# EAGLE design shield_layer2 (EAGLE 7.3.0)
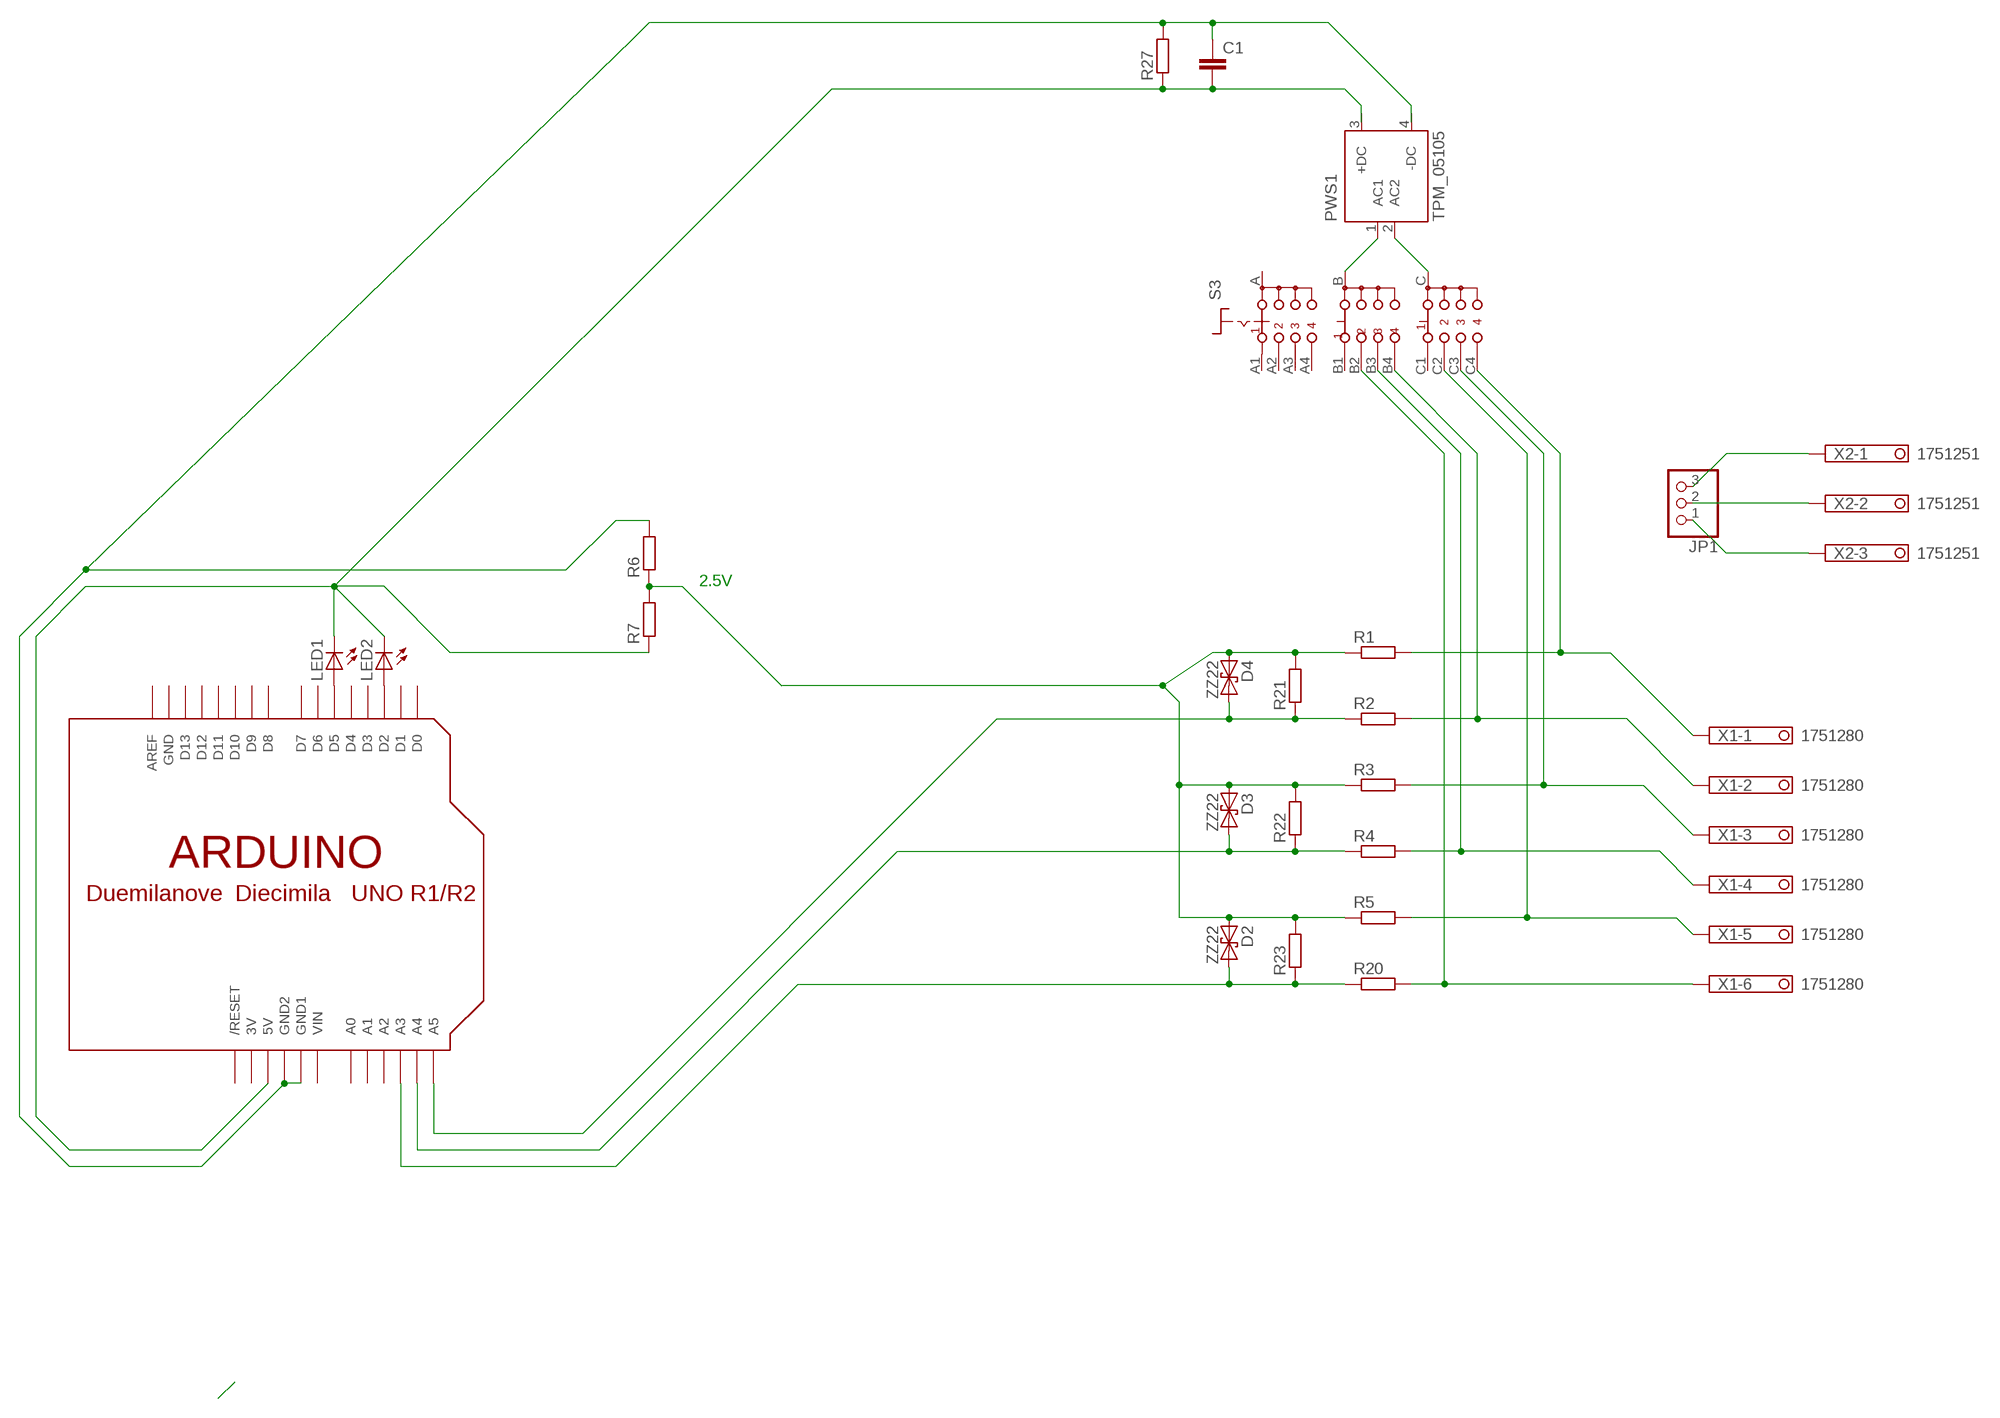
[diagram p0: schematic, sheet 1]

## Parts
C1  C-EU050-045X075  [C050-045X075]
D2  ZZ22  [P2-15]
D3  ZZ22  [P2-15]
D4  ZZ22  [P2-15]
JP1  PINHD-1X3CB  [1X03-CLEANBIG]
LED1  LED5MM  [LED5MM]
LED2  LED5MM  [LED5MM]
PWS1  TPM_05105  [05105]
R1  R-EU_0617/22  [0617/22]
R2  R-EU_0617/22  [0617/22]
R3  R-EU_0617/22  [0617/22]
R4  R-EU_0617/22  [0617/22]
R5  R-EU_0617/22  [0617/22]
R6  R-EU_0207/10  [0207/10]
R7  R-EU_0207/10  [0207/10]
R20  R-EU_0617/22  [0617/22]
R21  R-EU_0207/10  [0207/10]
R22  R-EU_0207/10  [0207/10]
R23  R-EU_0207/10  [0207/10]
R27  R-EU_0207/10  [0207/10]
S3  CK103X04  [CK103X04]
U$1  ARDUINOUNO  [ARDUINO]
X1  1751280  [1751280]
X2  1751251  [1751251]

## Nets
N$1: C1.2 LED1.K(C) LED2.K(C) R7.1 R27.1 U$1.5V
N$2: PWS1.1(AC1) S3.B
N$3: JP1.3 X2.1
N$4: JP1.2 X2.2
N$5: JP1.1 X2.3
N$6: PWS1.2(AC2) S3.C
N$13: D2.C R20.1 R23.1 U$1.A3
N$14: D3.C R4.1 R22.1 U$1.A4
N$18: D4.C R2.1 R21.1 U$1.A5
N$22: C1.1 R6.2 R27.2 U$1.GND1 U$1.GND2
N$35: LED2.A U$1.D2
N$36: LED1.A U$1.D5
N$41: R1.2 S3.C4 X1.1
N$43: R3.2 S3.C3 X1.3
N$44: D2.A D3.A D4.A R1.1 R3.1 R5.1 R6.1 R7.2 R21.2 R22.2 R23.2
N$45: R5.2 S3.C2 X1.5
N$46: R20.2 S3.B2 X1.6
N$47: R2.2 S3.B4 X1.2
N$48: R4.2 S3.B3 X1.4
Unconnected: PWS1.3(+DC) PWS1.4(-DC) S3.A S3.A1 S3.A2 S3.A3 S3.A4 S3.B1 S3.C1 U$1.A0 U$1.A1 U$1.A2 U$1.AREF U$1.D0 U$1.D1 U$1.D3 U$1.D4 U$1.D6 U$1.D7 U$1.D8 U$1.D9 U$1.D10 U$1.D11 U$1.D12 U$1.D13 U$1.RESET(/RESET)

## Notes on the sheet
- 2.5V

## Power pins joined to a net without a drawn wire
3V: U$1.3V
GND: U$1.GND
VIN: U$1.VIN

## Library data of the parts
C1 = resistor:C-EU: CAPACITOR, European symbol
D2-D4 = diode:ZZ22: DIODE
JP1 = adafruit:PINHD-1X3: PIN HEADER
LED1 LED2 = led:LED: LED OSRAM: - CHIPLED LG R971, LG N971, LY N971, LG Q971, LY Q971, LO R971, LY R971 LH N974, LH R974 LS Q976, LO Q976, LY Q976 LO Q996 - Hyper CHIPLED LW Q18S LB Q993, LB Q99A, LB R99A - SideLED LS A670, LO A670, LY A670, LG A670, LP A670 LB A673, LV A673, LT A673, LW A673 LH A674 LY A675 LS A676, LA A676, LO A676, LY A676, LW A676 LS A679, LY A679, LG A679 - Hyper Micro SIDELED® LS Y876, LA Y876, LO Y876, LY Y876 LT Y87S - SmartLED LW L88C, LW L88S LB L89C, LB L89S, LG L890 LS L89K, LO L89K, LY L89K LS L896, LA L896, LO L896, LY L896 - TOPLED LS T670, LO T670, LY T670, LG T670, LP T670 LSG T670, LSP T670, LSY T670, LOP T670, LYG T670 LG T671, LOG T671, LSG T671 LB T673, LV T673, LT T673, LW T673 LH T674 LS T676, LA T676, LO T676, LY T676, LB T676, LH T676, LSB T676, LW T676 LB T67C, LV T67C, LT T67C, LS T67K, LO T67K, LY T67K, LW E67C LS E67B, LA E67B, LO E67B, LY E67B, LB E67C, LV E67C, LT E67C LW T67C LS T679, LY T679, LG T679 LS T770, LO T770, LY T770, LG T770, LP T770 LB T773, LV T773, LT T773, LW T773 LH T774 LS E675, LA E675, LY E675, LS T675 LS T776, LA T776, LO T776, LY T776, LB T776 LHGB T686 LT T68C, LB T68C - Hyper Mini TOPLED® LB M676 - Mini TOPLED Santana® LG M470 LS M47K, LO M47K, LY M47K Source: http://www.osram.convergy.de LUXEON: - LUMILED® LXK2-PW12-R00, LXK2-PW12-S00, LXK2-PW14-U00, LXK2-PW14-V00 LXK2-PM12-R00, LXK2-PM12-S00, LXK2-PM14-U00 LXK2-PE12-Q00, LXK2-PE12-R00, LXK2-PE12-S00, LXK2-PE14-T00, LXK2-PE14-U00 LXK2-PB12-K00, LXK2-PB12-L00, LXK2-PB12-M00, LXK2-PB14-N00, LXK2-PB14-P00, LXK2-PB14-Q00 LXK2-PR12-L00, LXK2-PR12-M00, LXK2-PR14-Q00, LXK2-PR14-R00 LXK2-PD12-Q00, LXK2-PD12-R00, LXK2-PD12-S00 LXK2-PH12-R00, LXK2-PH12-S00 LXK2-PL12-P00, LXK2-PL12-Q00, LXK2-PL12-R00 Source: www.luxeon.com KINGBRIGHT: KA-3528ASYC Source: www.kingbright.com
PWS1 = traco-electronic:TPM_*: DC/DC Konverter 5 Watt, 1 x Input, 1 x Output Source: http://www.tracopower.com/datasheet_g/tpm-d.pdf; OC_FARNELL: unknown; OC_NEWARK: unknown
R1-R7 R20-R23 R27 = resistor:R-EU_: RESISTOR, European symbol
S3 = switch:CK103X04: ROTARY SWITCH C&K
U$1 = adafruit:ARDUINO: Arduino Diecimila/Duemilanove Make a shield with ease, this package has all the named pins as well as the two mounting drill holes and an outline of the USB and DC power connector. The outline is on the DIMENSION layer, so if your board house uses it they will cut the outline to match. http://www.ladyada.net/library/pcb/eaglelibrary.html
X1 = con-phoenix-350:1751280: MKDS 1/ 6-3,5 Printklemme Nennstrom: 10 A Bemessungsspannung: 160 V Raster: 3,5 mm Polzahl: 6 Montageart: Löten Anschlussart: Schraubanschluss Anschlussrichtung vom Leiter zur Platine: 0° Source: http://eshop.phoenixcontact.com .. 1751280.pdf; MPN: 1751280; OC_FARNELL: unknown; OC_NEWARK: 27R1765
X2 = con-phoenix-350:1751251: MKDS 1/ 3-3,5 Printklemme Nennstrom: 10 A Bemessungsspannung: 160 V Raster: 3,5 mm Polzahl: 3 Montageart: Löten Anschlussart: Schraubanschluss Anschlussrichtung vom Leiter zur Platine: 0° Source: http://eshop.phoenixcontact.com .. 1751251.pdf; OC_FARNELL: unknown; OC_NEWARK: unknown

## Board
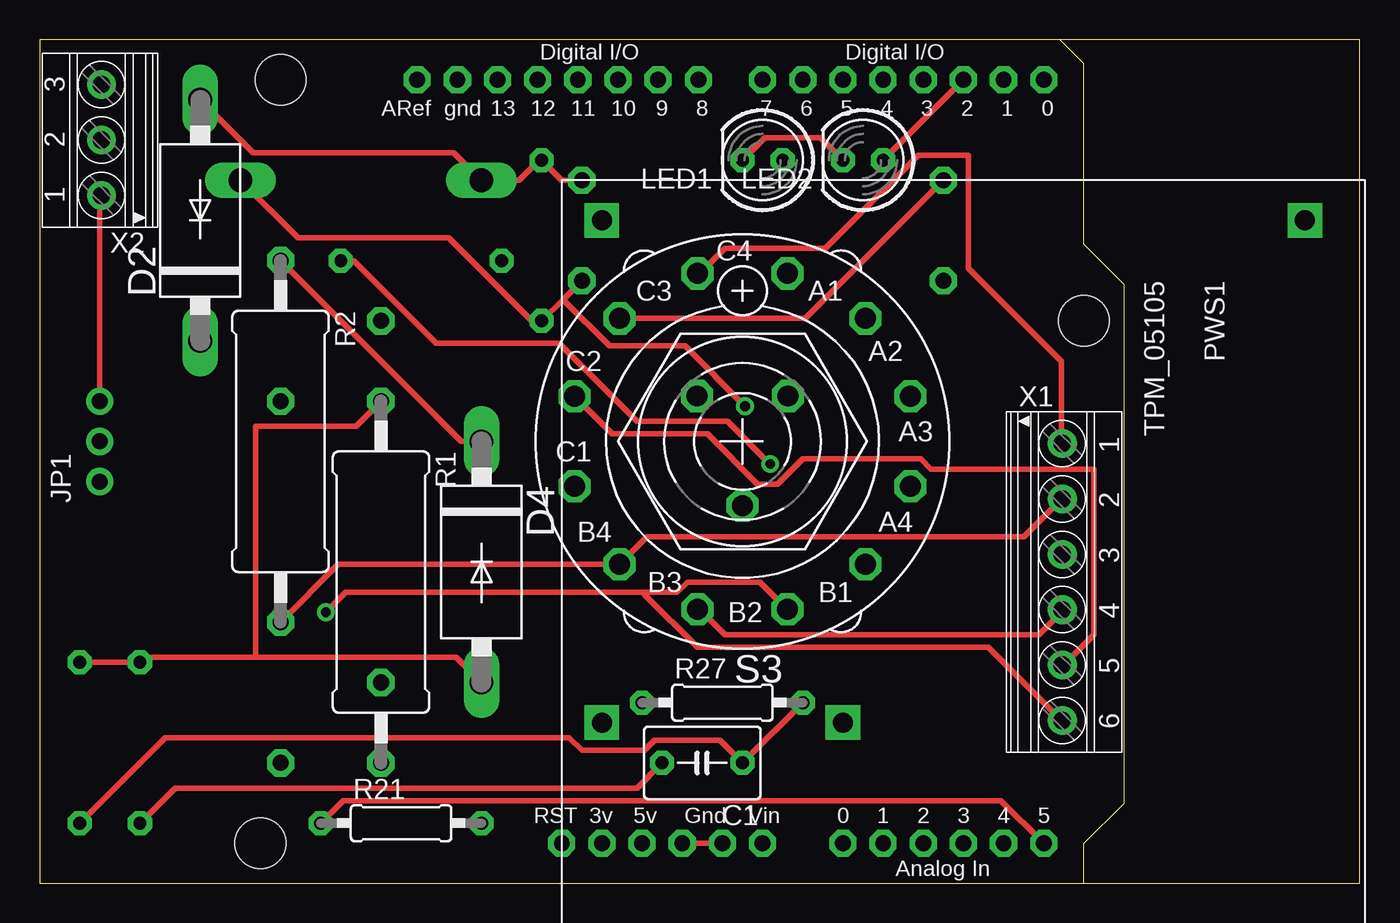
[diagram p1: board, top side]
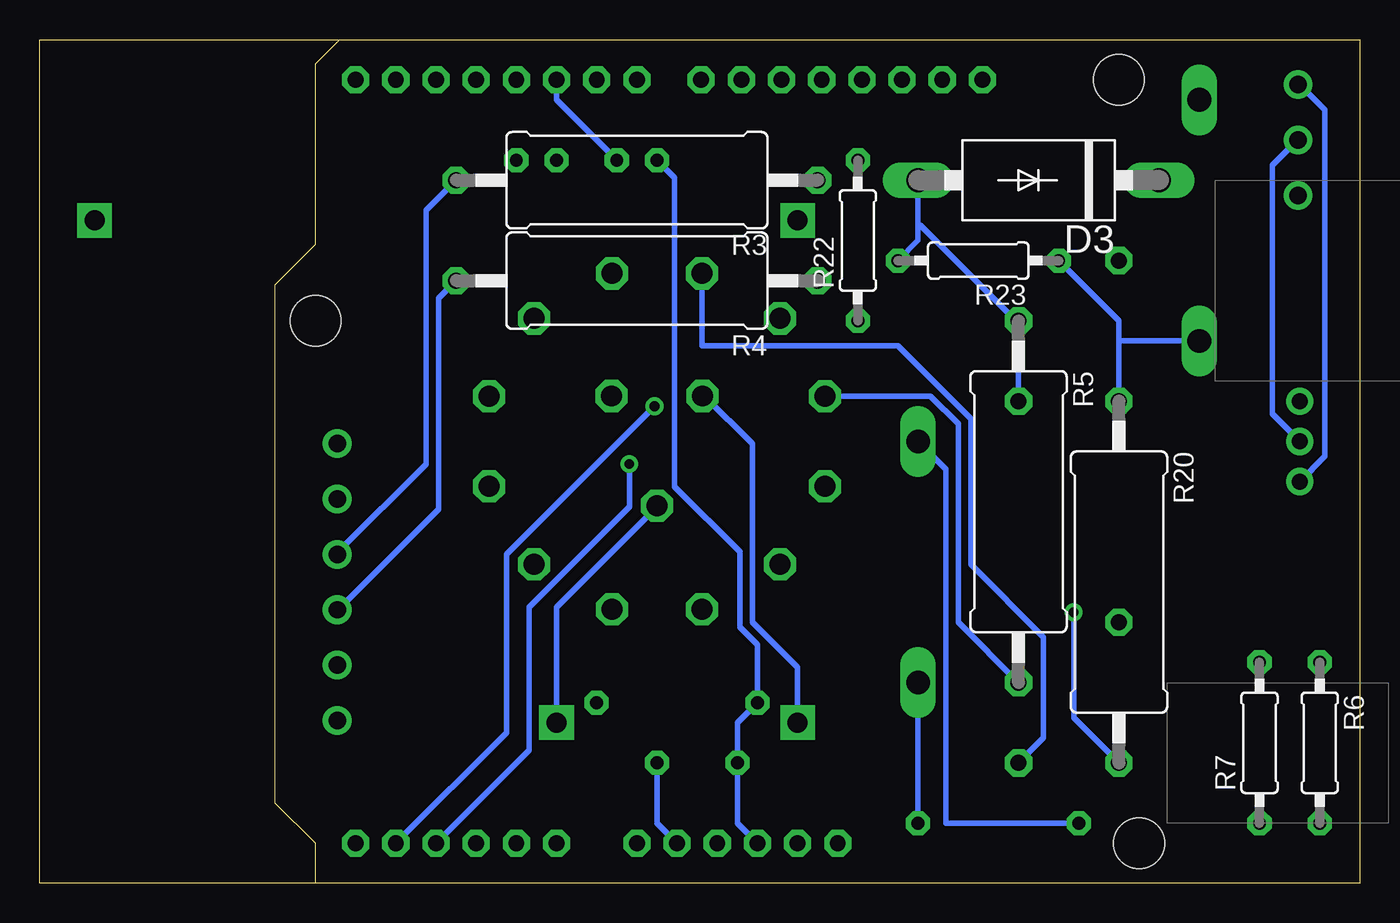
[diagram p2: board, bottom side, seen from below]

Size 83.49 x 53.34 mm. Coordinates in mm from the lower left corner, seen from the top.
Outline: 0,0 83.49,0 83.49,53.33 0,53.33 0,0
Copper layers (1*16): Top 0.035mm / dielectric 1.5mm / Bottom 0.035mm
Design rules "default *": minimum track width 14mil, minimum drill 24mil, track to track 16mil, track to pad 16mil, pad to pad 16mil, via to via 16mil, smd to smd 16mil, copper to edge 40mil, drill to drill 16mil, minimum pad ring 14mil, minimum via ring 10mil, stop-mask expansion 4mil, vias tented up to drill 0mil, thermal gap 10mil

### Footprints (pad centres in the part's own frame; a part is rotated, then mirrored left to right if it is on the bottom)
C050-045X075 = drill 0.813 octagon: 1 -2.54,0; 2 2.54,0
P2-15 = drill 1.499 long: A 7.62,0; C -7.62,0
1X03-CLEANBIG = drill 1.016 pad 1.676: 1 -2.54,0; 2 0,0; 3 2.54,0
LED5MM = drill 0.813 octagon: A -1.27,0; K 1.27,0
05105 = drill 1.27 pad 2.184 square: 1 34.29,17.78; 2 34.29,2.54; 3 2.54,2.54; 4 2.54,46.99
0617/22 = drill 1.016 octagon: 1 -11.43,0; 2 11.43,0
0207/10 = drill 0.813 octagon: 1 -5.08,0; 2 5.08,0
CK103X04 = drill 1.321 octagon: A -2.87,-2.87; A1 -2.845,-10.617; A2 -7.772,-7.772; A3 -10.617,-2.845; A4 -10.617,2.845; B 0,4.059; B1 -7.772,7.772; B2 -2.845,10.617; B3 2.845,10.617; B4 7.772,7.772; C 2.87,-2.87; C1 10.617,2.845; C2 10.617,-2.845; C3 7.772,-7.772; C4 2.845,-10.617
ARDUINO = drill 1 pad 1.676 octagon: 3V 35.56,2.54; 5V 38.1,2.54; A0 50.8,2.54; A1 53.34,2.54; A2 55.88,2.54; A3 58.42,2.54; A4 60.96,2.54; A5 63.5,2.54; AREF 23.876,50.8; D0 63.5,50.8; D1 60.96,50.8; D2 58.42,50.8; D3 55.88,50.8; D4 53.34,50.8; D5 50.8,50.8; D6 48.26,50.8; D7 45.72,50.8; D8 41.656,50.8; D9 39.116,50.8; D10 36.576,50.8; D11 34.036,50.8; D12 31.496,50.8; D13 28.956,50.8; GND 26.416,50.8; GND1 43.18,2.54; GND2 40.64,2.54; RESET 33.02,2.54; VIN 45.72,2.54 | hole 3.2: 15.24,50.8; 66.04,35.56; 13.97,2.54
1751280 = drill 1.1 pad 1.7: 1 -8.75,-0.1; 2 -5.25,-0.1; 3 -1.75,-0.1; 4 1.75,-0.1; 5 5.25,-0.1; 6 8.75,-0.1
1751251 = drill 1.1 pad 1.7: 1 -3.5,-0.1; 2 0,-0.1; 3 3.5,-0.1

### Placement (x,y rotation side)
C1  41.91,7.62 180 top
D2  10.16,41.91 90 top
D3  20.32,44.45 180 bottom
D4  27.94,20.32 270 top
JP1  3.81,27.94 90 top
LED1  45.72,45.72 180 top
LED2  52.07,45.72 180 top
PWS1  33.02,44.45 270 top
R1  21.59,19.05 270 top
R2  15.24,27.94 270 top
R3  45.72,44.45 180 bottom
R4  45.72,38.1 180 bottom
R5  21.59,24.13 270 bottom
R6  2.54,8.89 270 bottom
R7  6.35,8.89 90 bottom
R20  15.24,19.05 270 bottom
R21  22.86,3.81 0 top
R22  31.75,40.64 90 bottom
R23  24.13,39.37 180 bottom
R27  43.18,11.43 0 top
S3  44.45,27.94 180 top
U$1  0,0 0 top
X1  64.77,19.05 270 top
X2  3.81,46.99 90 top

### Tracks (layer width: path | path; a pad name or v marks a point on that pad's centre or on a via)
N$1
  Top 0.356: LED1.K 45.88,47.15 49.37,47.15 LED2.K | R7.1 8.57,6.03 37.78,6.03 C1.2
  Bottom 0.356: U$1.5V 39.37,3.81 C1.2 39.37,10.16 R27.1 38.1,15.08 39.21,16.19 39.21,20.95 43.34,25.08 43.34,44.61 LED1.K
N$2
  Bottom 0.356: PWS1.1 50.8,17.46 44.45,23.81 S3.B
N$3
  Top 0.356: JP1.3 3.81,43.34 X2.1
N$4
  Bottom 0.356: JP1.2 5.56,29.69 5.56,45.4 3.97,46.99 X2.2
N$5
  Bottom 0.356: JP1.1 2.22,26.99 2.22,48.9 3.81,50.48 X2.3
N$6
  Bottom 0.356: PWS1.2 35.56,13.65 38.42,16.51 38.42,27.78 41.43,30.8 S3.C
N$13  (via drill 0.61)
  Top 0.356: v46.2,26.51 43.5,29.21 37.78,29.21 32.86,34.13 25.08,34.13 19.84,39.37 R23.1
  Bottom 0.356: R23.1 15.24,35.56 15.24,34.29 | R20.1 15.24,34.29 | U$1.A3 52.55,8.41 52.55,17.46 46.2,23.81 v46.2,26.51 | 15.24,34.29 D2.C
N$14  (via drill 0.61)
  Top 0.356: R4.1 33.1,36.91 | 33.1,36.91 R22.1 31.11,35.56 25.88,40.8 16.35,40.8 D3.C | v44.61,30.16 40.8,33.97 36.04,33.97 33.1,36.91
  Bottom 0.356: U$1.A4 53.98,9.53 53.98,20.8 v44.61,30.16
N$18
  Top 0.356: U$1.A5 60.8,5.24 19.21,5.24 R21.1 | R2.1 26.67,27.94 D4.C
  Bottom 0.356: R21.1 26.19,3.81 26.19,26.19 D4.C
N$22
  Top 0.356: U$1.GND1 U$1.GND2 | R6.2 7.94,9.21 33.5,9.21 34.29,8.41 38.26,8.41 38.89,9.05 43.02,9.05 C1.1 44.45,7.78 44.61,7.78 R27.2
  Bottom 0.356: U$1.GND1 44.45,3.81 C1.1
N$35
  Top 0.356: U$1.D2 LED2.A
N$36
  Bottom 0.356: LED1.A 50.8,49.53 U$1.D5
N$41
  Top 0.356: X1.1 64.61,27.94 64.61,33.02 58.74,38.89 58.74,46.04 55.56,46.04 49.69,40.16 43.34,40.16 41.75,38.58 S3.C4
  Bottom 0.356: R1.2 20,9.21 20,15.56 24.61,20.16 24.61,29.37 29.21,33.97 41.59,33.97 41.59,38.42 S3.C4
N$43
  Top 0.356: R3.2 48.42,35.72 36.83,35.72 S3.C3
  Bottom 0.356: R3.2 59.05,42.55 59.05,26.51 64.61,20.95 X1.3
N$44
  Top 0.356: R6.1 R7.2 6.51,13.97 6.83,14.29 13.65,14.29 | 13.65,14.29 26.35,14.29 D4.A | R3.1 33.02,44.45 R22.2 31.59,45.72 30.32,44.45 D3.A 26.19,46.2 13.49,46.2 D2.A | 13.65,14.29 13.65,28.89 20,28.89 R1.1
  Bottom 0.356: D4.A R21.2 | R1.1 R5.1 21.75,35.56 27.78,41.59 27.94,41.59 | R23.2 27.94,40.64 27.94,41.59 | D3.A 27.94,41.59
N$45
  Top 0.356: X1.5 64.77,13.81 66.67,15.72 66.67,26.19 56.36,26.19 55.72,26.83 48.26,26.83 46.67,25.24 45.4,25.24 42.23,28.42 36.2,28.42 33.97,30.64 S3.C2
  Bottom 0.356: R5.2 25.4,16.51 25.4,29.05 27.15,30.8 33.81,30.8 S3.C2
N$46  (via drill 0.61)
  Top 0.356: v18.1,17.14 19.37,18.41 38.26,18.41 | 38.26,18.41 40.32,18.41 40.96,19.05 45.56,19.05 47.15,17.46 S3.B2 | X1.6 64.61,10.32 60.01,14.92 41.59,14.92 38.26,18.26 38.26,18.41
  Bottom 0.356: R20.2 18.1,10.48 v18.1,17.14
N$47
  Top 0.356: R2.2 18.89,20.16 S3.B4 38.42,21.91 62.23,21.91 64.61,24.29 X1.2
N$48
  Top 0.356: S3.B3 41.75,17.3 43.34,15.72 63.18,15.72 64.61,17.14 X1.4
  Bottom 0.356: R4.2 58.26,36.99 58.26,23.65 64.61,17.3 X1.4